# EAGLE design serialLogger (EAGLE 6.4)
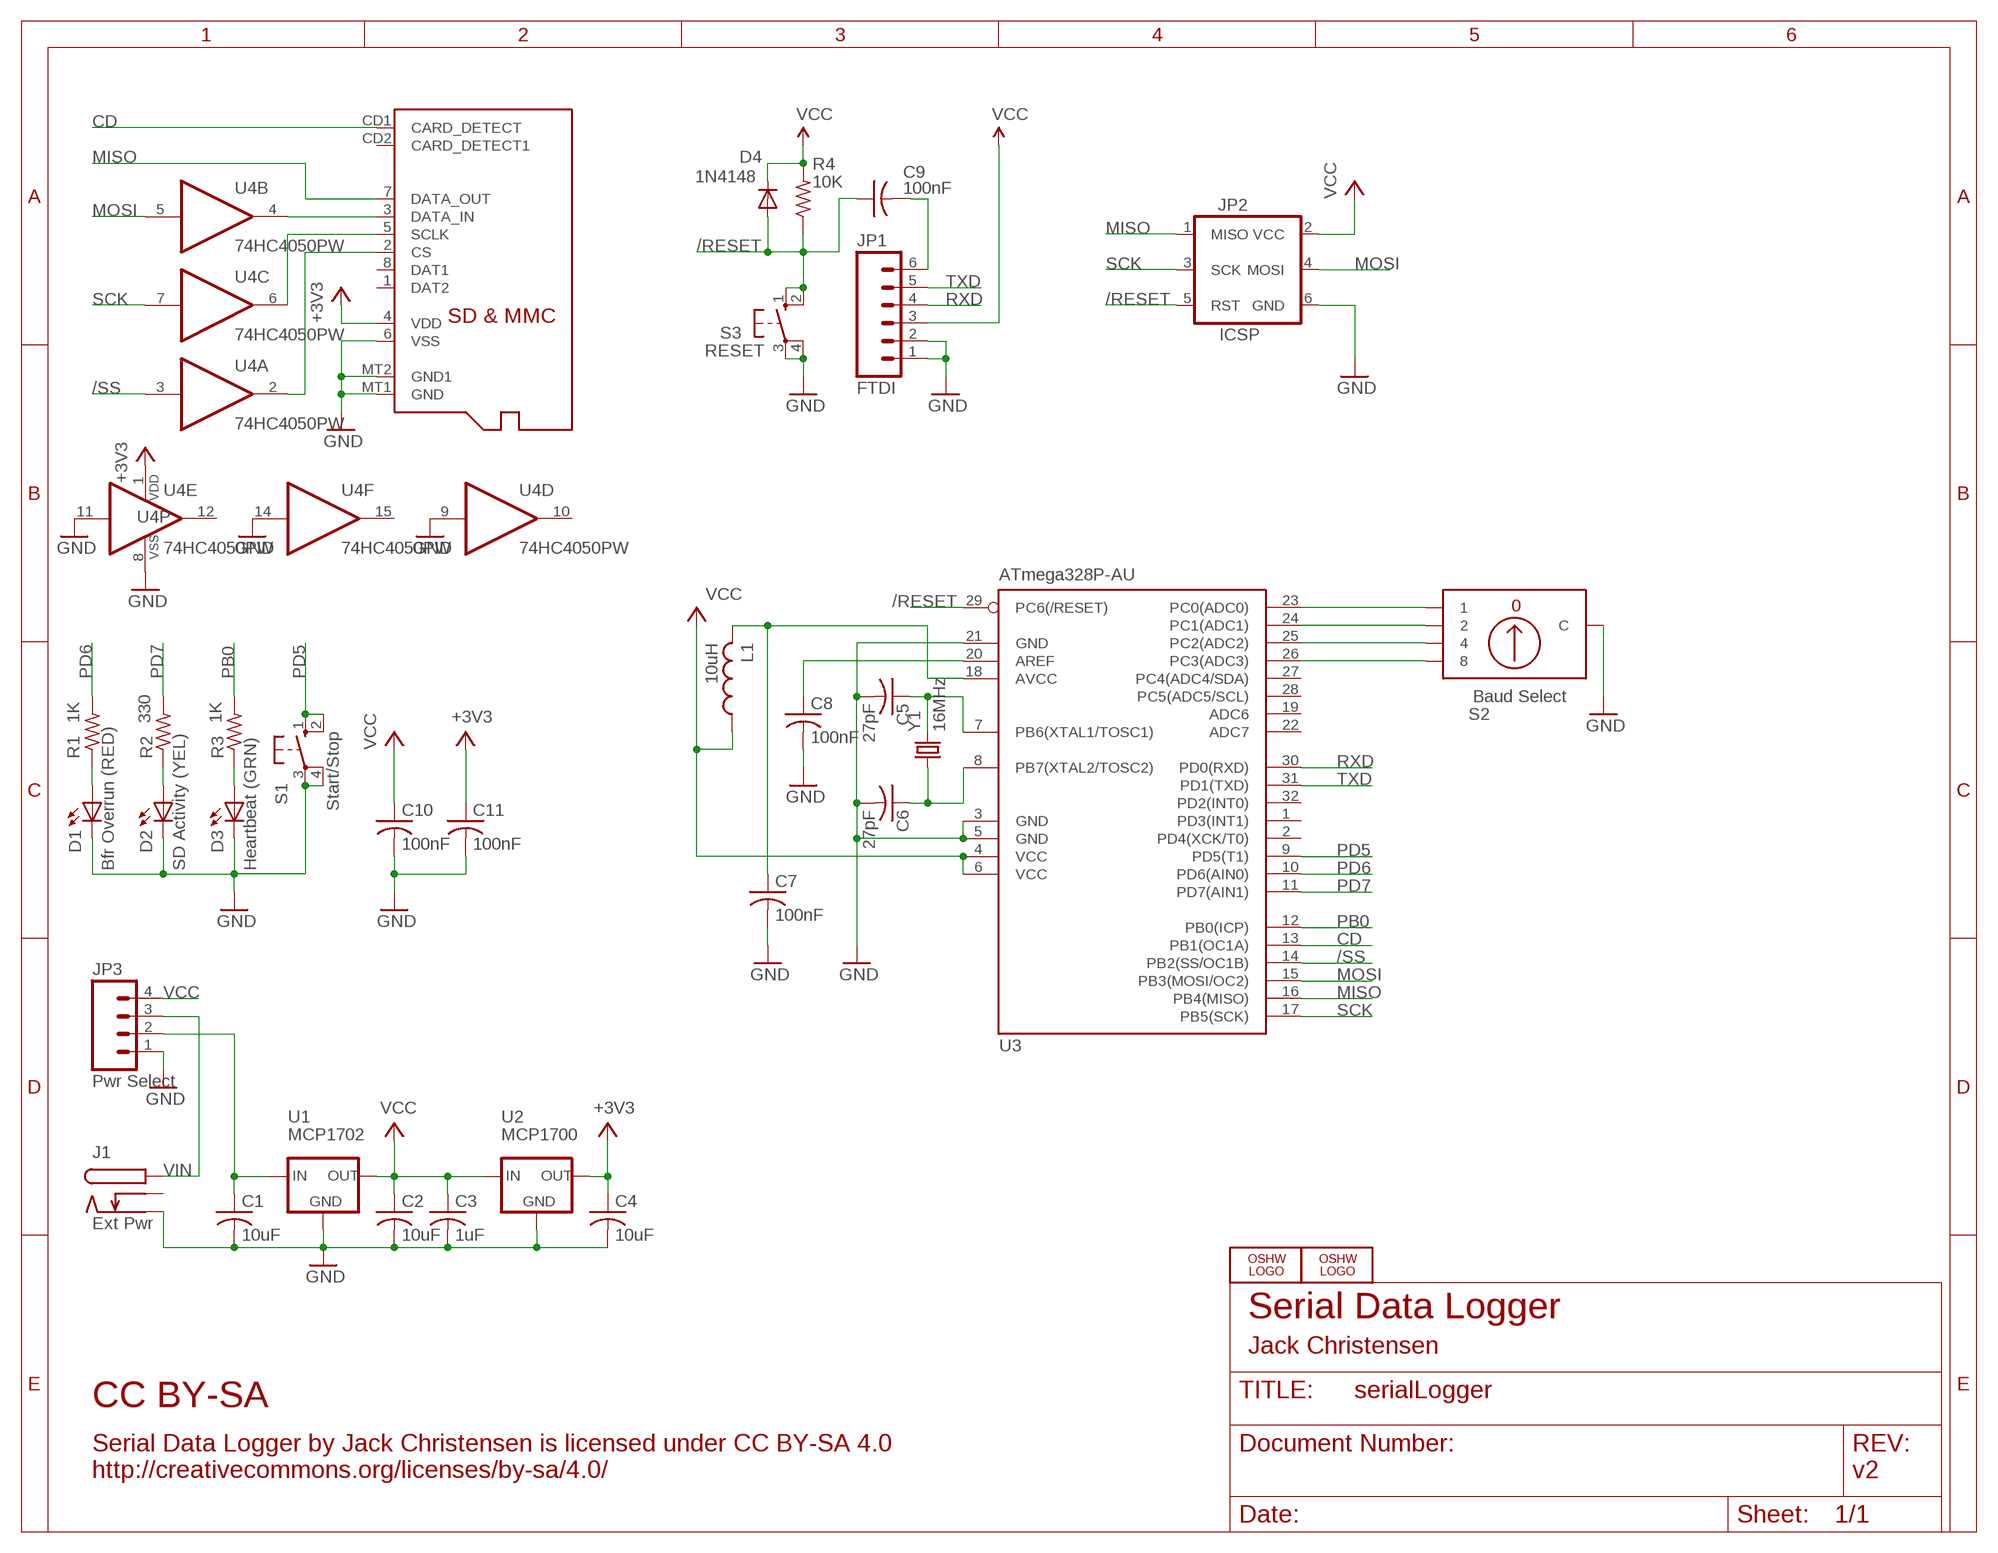
[diagram p0: schematic, sheet 1]

## Parts
C1  10uF  C-USM0805  [M0805]
C2  10uF  C-USM0805  [M0805]
C3  1uF  C-USM0805  [M0805]
C4  10uF  C-USM0805  [M0805]
C5  27pF  C-USM0805  [M0805]
C6  27pF  C-USM0805  [M0805]
C7  100nF  C-USM0805  [M0805]
C8  100nF  C-USM0805  [M0805]
C9  100nF  C-USM0805  [M0805]
C10  100nF  C-USM0805  [M0805]
C11  100nF  C-USM0805  [M0805]
D1  Bfr Overrun (RED)  LEDCHIPLED_1206  [CHIPLED_1206]
D2  SD Activity (YEL)  LEDCHIPLED_1206  [CHIPLED_1206]
D3  Heartbeat (GRN)  LEDCHIPLED_1206  [CHIPLED_1206]
D4  1N4148  DIODESOD-323F-A  [SOD-323F-A]
J1  Ext Pwr  POWER-JACK  [KLDX-0202]
JP1  FTDI  M06LOCK  [1X06_LOCK]
JP2  ICSP  AVR_SPI_PRG_62X3_LOCK  [2X3_LOCK]
JP3  Pwr Select  M04LOCK  [1X04_LOCK]
L1  10uH  INDUCTORM0805  [M0805]
LOGO1  OSHW_LOGO_10MILX0200-NT  [OSHW_10X200_NOTEXT]
LOGO2  OSHW_LOGO_10MILX0200-NT  [OSHW_10X200_NOTEXT]
R1  1K  R-US_M0805  [M0805]
R2  330  R-US_M0805  [M0805]
R3  1K  R-US_M0805  [M0805]
R4  10K  R-US_M0805  [M0805]
S1  Start/Stop  10-XXOCT  [B3F-10XXOCT]
S2  Baud Select  OMRON-A6RS-102  [OMRON-A6RS-102]
S3  RESET  10-XXOCT  [B3F-10XXOCT]
U1  MCP1702  MCP1700SOT89  [SOT89]
U2  MCP1700  MCP1700SOT23  [SOT23]
U3  ATmega328P-AU  MEGA8-AI  [TQFP32-08]
U4  74HC4050PW  4050PW  [TSSOP16]
X1  MICROSD  [MICROSD]
Y1  16MHz  CRYSTALABM2  [CRYSTAL-ABRACON-ABM2]

## Nets
+3V3: C4.1 C11.1 U2.2(OUT) U4.1(P:VDD) X1.4(VDD)
/RESET: C9.1 D4.A JP2.5(RST) R4.1 S3.1(S) S3.2(S1) U3.29(PC6(/RESET))
/SS: U3.14(PB2(SS/OC1B)) U4.3(A:I)
CD: U3.13(PB1(OC1A)) X1.CD1(CARD_DETECT)
GND: C1.2 C2.2 C3.2 C4.2 C5.2 C6.2 C7.2 C8.2 C10.2 C11.2 D1.C D2.C D3.C J1.P$2 JP1.1 JP1.2 JP2.6(GND) JP3.1 S1.3(P) S1.4(P1) S2.C.1(C) S2.C.2(C) S3.3(P) S3.4(P1) U1.1(GND) U2.1(GND) U3.3(GND) U3.5(GND) U3.21(GND) U4.8(P:VSS) U4.9(D:I) U4.11(E:I) U4.14(F:I) X1.6(VSS) X1.MT1(GND) X1.MT2(GND1)
MISO: JP2.1(MISO) U3.16(PB4(MISO)) X1.7(DATA_OUT)
MOSI: JP2.4(MOSI) U3.15(PB3(MOSI/OC2)) U4.5(B:I)
N$1: D3.A R3.1
N$2: D2.A R2.1
N$3: D1.A R1.1
N$4: C1.1 JP3.2 U1.2(IN) U1.2.1(IN)
N$5: S2.1 U3.23(PC0(ADC0))
N$6: S2.2 U3.24(PC1(ADC1))
N$7: S2.4 U3.25(PC2(ADC2))
N$8: S2.8 U3.26(PC3(ADC3))
N$10: U4.6(C:O) X1.5(SCLK)
N$15: U4.2(A:O) X1.2(CS)
N$17: U4.4(B:O) X1.3(DATA_IN)
N$18: C5.1 U3.7(PB6(XTAL1/TOSC1)) Y1.P$2
N$19: C6.1 U3.8(PB7(XTAL2/TOSC2)) Y1.P$1
N$20: C8.1 U3.20(AREF)
N$37: C7.1 L1.2 U3.18(AVCC)
PB0: R3.2 U3.12(PB0(ICP))
PD5: S1.1(S) S1.2(S1) U3.9(PD5(T1))
PD6: R1.2 U3.10(PD6(AIN0))
PD7: R2.2 U3.11(PD7(AIN1))
RST: C9.2 JP1.6
RXD: JP1.4 U3.30(PD0(RXD))
SCK: JP2.3(SCK) U3.17(PB5(SCK)) U4.7(C:I)
TXD: JP1.5 U3.31(PD1(TXD))
VCC: C2.1 C3.1 C10.1 D4.K JP1.3 JP2.2(VCC) JP3.4 L1.1 R4.2 U1.3(OUT) U2.3(IN) U3.4(VCC) U3.6(VCC)
VIN: J1.P$1 JP3.3
Unconnected: J1.P$3 U3.1(PD3(INT1)) U3.2(PD4(XCK/T0)) U3.19(ADC6) U3.22(ADC7) U3.27(PC4(ADC4/SDA)) U3.28(PC5(ADC5/SCL)) U3.32(PD2(INT0)) U4.10(D:O) U4.12(E:O) U4.15(F:O) X1.1(DAT2) X1.8(DAT1) X1.CD2(CARD_DETECT1)

## Notes on the sheet
- Serial Data Logger
- Jack Christensen
- CC BY-SA
- Serial Data Logger by Jack Christensen is licensed under CC BY-SA 4.0
  http://creativecommons.org/licenses/by-sa/4.0/
- v2

## Library data of the parts
C1-C11 = _jc:C-US: CAPACITOR, American symbol
D1-D3 = _jc:LED: LED OSRAM: - CHIPLED LG R971, LG N971, LY N971, LG Q971, LY Q971, LO R971, LY R971 LH N974, LH R974 LS Q976, LO Q976, LY Q976 LO Q996 - Hyper CHIPLED LW Q18S LB Q993, LB Q99A, LB R99A - SideLED LS A670, LO A670, LY A670, LG A670, LP A670 LB A673, LV A673, LT A673, LW A673 LH A674 LY A675 LS A676, LA A676, LO A676, LY A676, LW A676 LS A679, LY A679, LG A679 - Hyper Micro SIDELED® LS Y876, LA Y876, LO Y876, LY Y876 LT Y87S - SmartLED LW L88C, LW L88S LB L89C, LB L89S, LG L890 LS L89K, LO L89K, LY L89K LS L896, LA L896, LO L896, LY L896 - TOPLED LS T670, LO T670, LY T670, LG T670, LP T670 LSG T670, LSP T670, LSY T670, LOP T670, LYG T670 LG T671, LOG T671, LSG T671 LB T673, LV T673, LT T673, LW T673 LH T674 LS T676, LA T676, LO T676, LY T676, LB T676, LH T676, LSB T676, LW T676 LB T67C, LV T67C, LT T67C, LS T67K, LO T67K, LY T67K, LW E67C LS E67B, LA E67B, LO E67B, LY E67B, LB E67C, LV E67C, LT E67C LW T67C LS T679, LY T679, LG T679 LS T770, LO T770, LY T770, LG T770, LP T770 LB T773, LV T773, LT T773, LW T773 LH T774 LS E675, LA E675, LY E675, LS T675 LS T776, LA T776, LO T776, LY T776, LB T776 LHGB T686 LT T68C, LB T68C - Hyper Mini TOPLED® LB M676 - Mini TOPLED Santana® LG M470 LS M47K, LO M47K, LY M47K Source: http://www.osram.convergy.de/
D4 = _jc:DIODE
J1 = _jc:POWER-JACK
JP1 = SparkFun:M06: Header 6 Standard 6-pin 0.1" header. Use with straight break away headers (SKU : PRT-00116), right angle break away headers (PRT-00553), swiss pins (PRT-00743), machine pins (PRT-00117), and female headers (PRT-00115). Molex polarized connector foot print use with SKU : PRT-08094 with associated crimp pins and housings. NOTES ON THE VARIANTS LOCK and LOCK_LONGPADS... This footprint was designed to help hold the alignment of a through-hole component (i.e. 6-pin header) while soldering it into place. You may notice that each hole has been shifted either up or down by 0.005 of an inch from it's more standard position (which is a perfectly straight line). This slight alteration caused the pins (the squares in the middle) to touch the edges of the holes. Because they are alternating, it causes a "brace" to hold the component in place. 0.005 has proven to be the perfect amount of "off-center" position when using our standard breakaway headers. Although looks a little odd when you look at the bare footprint, once you have a header in there, the alteration is very hard to notice. Also, if you push a header all the way into place, it is covered up entirely on the bottom side. This idea of altering the position of holes to aid alignment will be further integrated into the Sparkfun Library for other footprints. It can help hold any component with 3 or more connection pins.
JP2 = _jc:AVR_SPI_PRG_6: AVR ISP 6 Pin This is the reduced ISP connector for AVR programming. Common on Arduino. This footprint will take up less PCB space and can be used with a 10-pin to 6-pin adapter such as SKU: BOB-08508
JP3 = SparkFun:M04: Header 4 Standard 4-pin 0.1" header. Use with straight break away headers (SKU : PRT-00116), right angle break away headers (PRT-00553), swiss pins (PRT-00743), machine pins (PRT-00117), and female headers (PRT-00115). Molex polarized connector foot print use with SKU : PRT-08231 with associated crimp pins and housings.
L1 = _jc:INDUCTOR: Murata #11R472C
LOGO1 LOGO2 = ohw-logo:OSHW_LOGO_10MIL
R1-R4 = _jc:R-US_: RESISTOR, American symbol
S1 S3 = _jc:10-XX: OMRON SWITCH
S2 = _jc:OMRON-A6RS-102
U1 U2 = _jc:MCP1700: VOLTAGE REGULATOR
U3 = atmel:MEGA8: MICROCONTROLLER 8 Kbytes FLASH, 1 kbytes SRAM, 512 bytes EEPROM, USART, 6-channel 10 bit ADC, 2-channel 8 bit ADC Pin compatible with Atmega48, ATMega88, ATMega168 Source: avr.lbr; MPN: ATMEGA8-16AU; OC_FARNELL: 9171371; OC_NEWARK: 73M8863
U4 = 40xx:4050: Hex non-inverting BUFFER
X1 = adafruit:MICROSD: Micro-SD / Transflash card holder with SPI pinout For the 3M # 2908-05WB-MG and/or 4UCON #19656 push-push type
Y1 = _jc:CRYSTAL

## Board
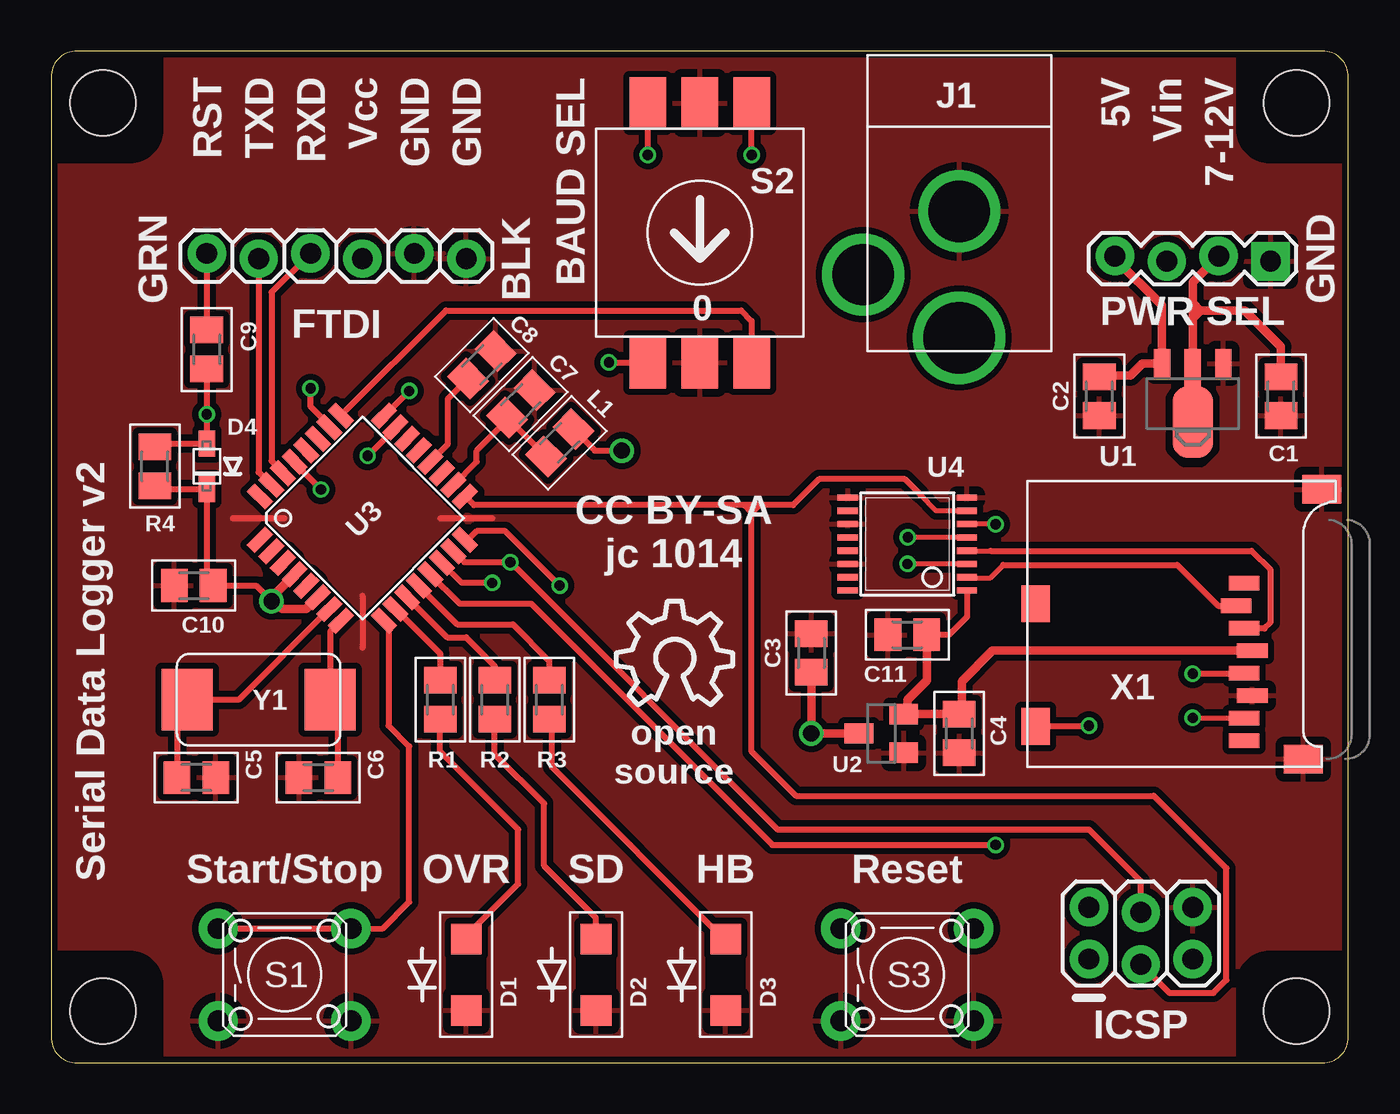
[diagram p1: board, top side]
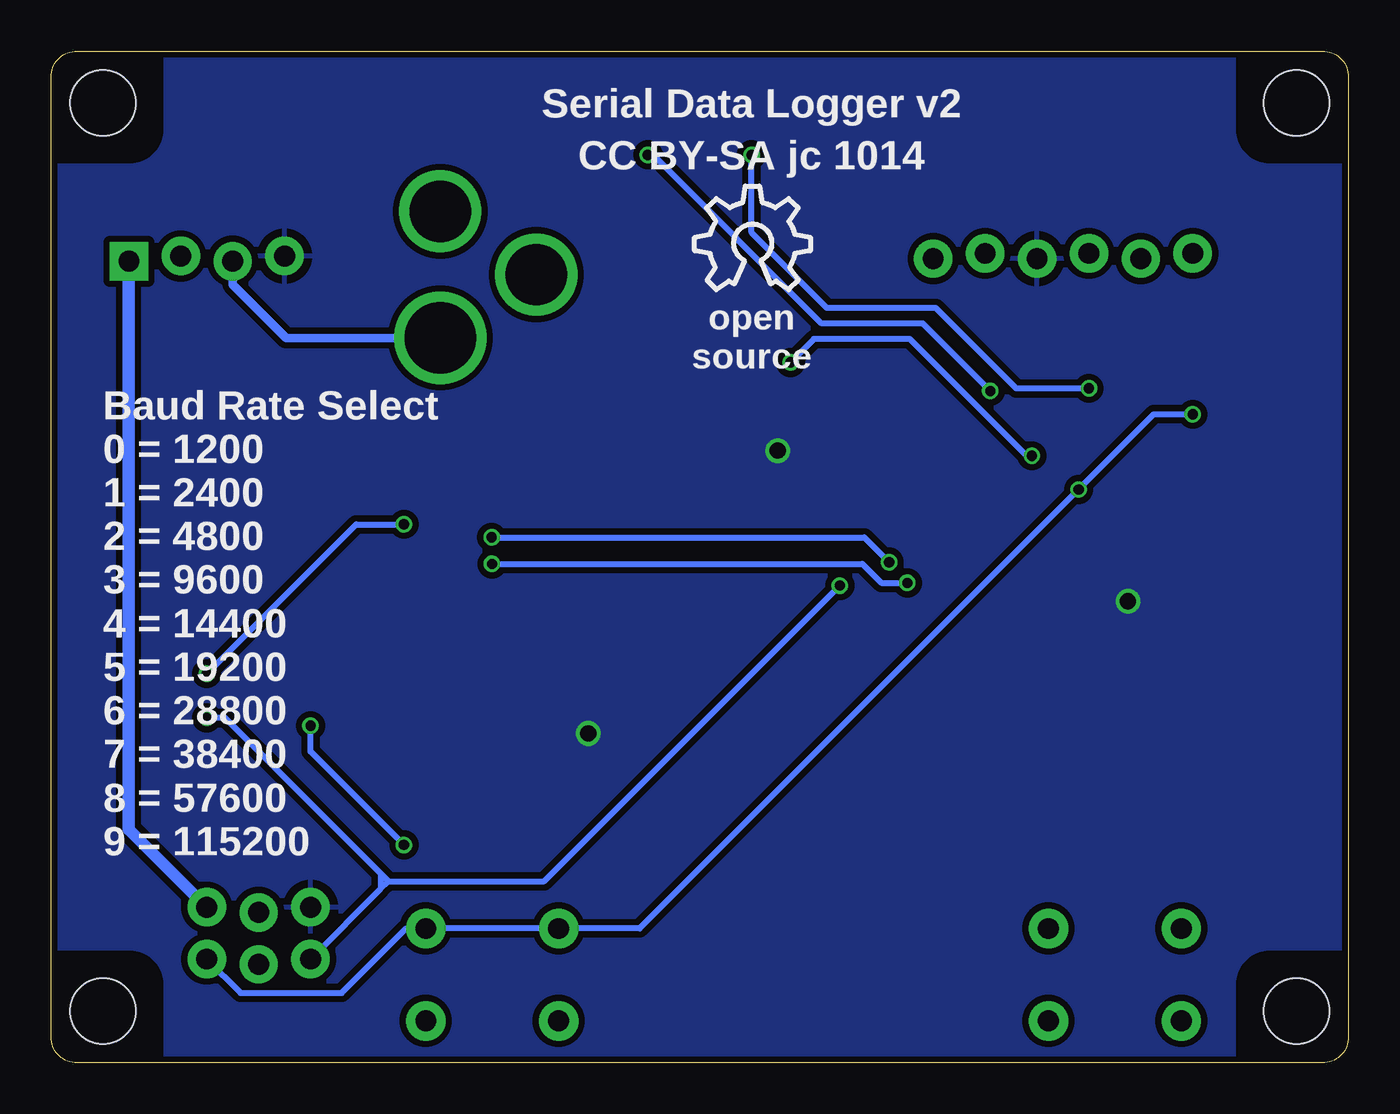
[diagram p2: board, bottom side, seen from below]

Size 63.5 x 49.53 mm. Coordinates in mm from the lower left corner, seen from the top.
Outline: 63.5,1.27 63.5,48.26 arc90 62.23,49.53 1.27,49.53 arc90 0,48.26 0,1.27 arc90 1.27,0 62.23,0 arc90 63.5,1.27
Copper layers (1*16): Top 0.035mm / dielectric 1.5mm / Bottom 0.035mm
Design rules "SeeedStudio_DRU_jc_20140311 *": minimum track width 8mil, minimum drill 12mil, track to track 8mil, track to pad 8mil, pad to pad 8mil, via to via 8mil, smd to smd 0mil, copper to edge 10mil, drill to drill 10mil, minimum pad ring 6mil, minimum via ring 6mil, stop-mask expansion 2mil, vias tented up to drill 25mil, thermal gap 16mil
Holes 3.2 mm at 2.54,2.54 60.96,2.54 2.54,46.99 60.96,46.99
tRestrict: area 0,44.5 to 5.1,49.5; area 58.4,44.5 to 63.5,49.5; area 58.4,0 to 63.5,5.1; area 0,0 to 5.1,5.1
bRestrict: area 58.4,44.5 to 63.5,49.5; area 0,44.5 to 5.1,49.5; area 0,0 to 5.1,5.1; area 58.4,0 to 63.5,5.1

### Footprints (pad centres in the part's own frame; a part is rotated, then mirrored left to right if it is on the bottom)
M0805 = smd 1.3 x 1.6: 1 -0.95,0; 2 0.95,0
CHIPLED_1206 = smd 1.5 x 1.5: A 0,-1.75; C 0,1.75
SOD-323F-A = smd 1.27 x 0.813: A -1.118,0; K 1.118,0
KLDX-0202 = drill 3.5: P$1 6.55,0 | drill 3: P$2 0.35,0; P$3 3.45,-4.7
1X06_LOCK = drill 1.016 pad 1.88: 1 0,0; 2 2.54,-0.254; 3 5.08,0; 4 7.62,-0.254; 5 10.16,0; 6 12.7,-0.254
2X3_LOCK = drill 1.016 pad 1.88: 1 0,0; 2 0,2.54; 3 2.54,-0.254; 4 2.54,2.286; 5 5.08,0; 6 5.08,2.54
1X04_LOCK = drill 1.016 pad 1.88 square: 1 0,0.127 | drill 1.016 pad 1.88: 2 2.54,-0.127; 3 5.08,0.127; 4 7.62,-0.127
B3F-10XXOCT = drill 1.016 pad 1.93: 1 -3.251,2.261; 2 3.251,2.261; 3 -3.251,-2.261; 4 3.251,-2.261
OMRON-A6RS-102 = smd 1.778 x 2.54: 1 -2.54,-6.35; 2 2.54,6.35; 4 2.54,-6.35; 8 -2.54,6.35; C.1 0,-6.35; C.2 0,6.35
SOT89 = smd 0.8 x 1.4: 1 -1.499,-1.981; 3 1.499,-1.981 | smd 0.8 x 1.9: 2 0,-1.727 | smd 2 x 3.5: 2.1 0,0.889
SOT23 = smd 1 x 1.4: 1 -0.95,-1.1; 2 0.95,-1.1; 3 0,1.1
TQFP32-08 = smd 1.27 x 0.559: 1 -4.293,2.8; 2 -4.293,2; 3 -4.293,1.2; 4 -4.293,0.4; 5 -4.293,-0.4; 6 -4.293,-1.2; 7 -4.293,-2; 8 -4.293,-2.8; 17 4.293,-2.8; 18 4.293,-2; 19 4.293,-1.2; 20 4.293,-0.4; 21 4.293,0.4; 22 4.293,1.2; 23 4.293,2; 24 4.293,2.8 | smd 0.559 x 1.27: 9 -2.8,-4.293; 10 -2,-4.293; 11 -1.2,-4.293; 12 -0.4,-4.293; 13 0.4,-4.293; 14 1.2,-4.293; 15 2,-4.293; 16 2.8,-4.293; 25 2.8,4.293; 26 2,4.293; 27 1.2,4.293; 28 0.4,4.293; 29 -0.4,4.293; 30 -1.2,4.293; 31 -2,4.293; 32 -2.8,4.293
TSSOP16 = smd 0.305 x 0.991: 1 -2.275,-2.918; 2 -1.625,-2.918; 3 -0.975,-2.918; 4 -0.325,-2.918; 5 0.325,-2.918; 6 0.975,-2.918; 7 1.625,-2.918; 8 2.275,-2.918; 9 2.275,2.918; 10 1.625,2.918; 11 0.975,2.918; 12 0.325,2.918; 13 -0.325,2.918; 14 -0.975,2.918; 15 -1.625,2.918; 16 -2.275,2.918
MICROSD = smd 0.7 x 1.5: 1 9,-10.64; 2 7.9,-10.24; 3 6.8,-10.64; 4 5.7,-11.04; 5 4.6,-10.64; 6 3.5,-11.04; 7 2.4,-10.64; 8 1.3,-10.64 | smd 1.8 x 1.4: CD1 2,-0.44; CD2 8,-0.44 | smd 1.4 x 1.9: MT1 0.4,-13.54; MT2 13.6,-14.44
CRYSTAL-ABRACON-ABM2 = smd 2.5 x 3: P$1 -3.5,0; P$2 3.5,0

### Placement (x,y rotation side)
C1  60.2,32.64 270 top
C2  51.31,32.64 270 top
C3  37.21,20.07 90 top
C4  44.45,16.13 270 top
C5  7.11,13.97 0 top
C6  13.08,13.97 180 top
C7  22.99,32.26 45 top
C8  21.08,34.16 45 top
C9  7.62,34.92 90 top
C10  6.99,23.37 180 top
C11  41.91,20.95 180 top
D1  20.32,4.32 180 top
D2  26.67,4.32 180 top
D3  33.02,4.32 180 top
D4  7.62,29.21 270 top
J1  44.45,42.04 270 top
JP1  20.32,39.37 180 top
JP2  50.8,5.08 0 top
JP3  59.69,39.37 180 top
L1  24.89,30.35 225 top
LOGO1  27.69,17.53 0 top
LOGO2  32,37.85 0 bottom
R1  19.05,17.78 90 top
R2  21.72,17.78 90 top
R3  24.38,17.78 90 top
R4  5.08,29.21 270 top
S1  11.43,4.32 0 top
S2  31.75,40.64 0 top
S3  41.91,4.32 0 top
U1  55.88,32.26 180 top
U2  40.64,16.13 90 top
U3  15.24,26.67 45 top
U4  41.91,25.4 90 top
X1  47.75,14.48 90 top
Y1  10.16,17.78 180 top

### Tracks (layer width: path | path; a pad name or v marks a point on that pad's centre or on a via)
+3V3
  Top 0.305: U4.1 44.83,21.84 43.94,20.95 C11.1
  Top 0.406: X1.4 46.09,20.18 44.58,18.67 44.58,17.21 C4.1 U2.2 41.91,17.25 41.91,17.78 42.86,18.73 C11.1
/RESET  (via drill 0.5)
  Top 0.305: U3.29 11.92,29.35 v13.21,28.07 | C9.1 v7.62,31.75 D4.A 5.25,30.33 R4.1
  Bottom 0.305: JP2.5 54.23,3.43 49.28,3.43 46.13,6.58 S3.2 S3.1 34.7,6.58 v13.21,28.07 9.53,31.75 v7.62,31.75
/SS  (via drill 0.5)
  Top 0.254: U4.3 v41.92,24.43
  Top 0.305: v21.59,23.5 20.11,23.5 U3.14
  Bottom 0.305: v21.59,23.5 22.86,23.5 23.79,24.43 v41.92,24.43
CD  (via drill 0.5)
  Top 0.305: U3.13 20,22.48 23.5,22.48 35.31,10.67 v46.23,10.67 | v50.8,16.51 50.77,16.48 X1.CD1
  Bottom 0.305: v46.23,10.67 50.8,15.24 v50.8,16.51
GND
  Top 0.305: 15.24,22.86 15.24,20.32 | 19.05,26.67 21.59,26.67 | 8.89,26.67 11.43,26.67
  Bottom 0.61: JP2.6 59.69,11.43 JP3.1
  pour Top (isolate 0.305): 64.77,-1.27 -1.27,-1.27 -1.27,50.8 64.77,50.8
MISO  (via drill 0.5)
  Top 0.254: v55.88,16.89 58.38,16.89 X1.7
  Top 0.305: v24.89,23.37 22.23,26.04 20.83,26.04 20.41,25.61 U3.16
  Bottom 0.305: v24.89,23.37 39.37,8.89 46.99,8.89 | JP2.1 47.37,8.51 | 47.37,8.51 46.99,8.89 | 46.99,8.89 47.37,9.27 | 47.37,9.27 54.99,16.89 v55.88,16.89 | 47.37,9.27 47.37,8.51
MOSI  (via drill 0.5)
  Top 0.254: U4.5 v41.94,25.73
  Top 0.305: U3.15 20.23,24.51 v22.48,24.51 35.56,11.43 50.8,11.43 53.34,8.89 JP2.4
  Bottom 0.305: v41.94,25.73 23.7,25.73 v22.48,24.51
N$1
  Top 0.305: D3.A 32.92,6.07 24.51,14.48 24.51,16.7 R3.1
N$2
  Top 0.305: D2.A 26.67,7.11 24.13,9.65 24.13,12.7 21.72,15.11 R2.1
N$3
  Top 0.305: D1.A 20.32,6.22 22.86,8.76 22.86,11.43 19.05,15.24 R1.1
N$4
  Top 0.406: JP3.2 55.88,38.23 55.88,37.21 | 55.88,37.21 55.88,36.83 | 55.88,36.45 U1.2 U1.2.1 | C1.1 60.2,35.05 58.42,36.83 56.26,36.83 | 56.26,36.83 55.88,36.83 | 56.26,36.83 55.88,36.45 | 55.88,36.45 55.88,36.83 | 55.88,37.21 56.26,36.83
N$5  (via drill 0.5)
  Top 0.305: U3.23 16.86,31.09 v15.49,29.72 | v27.3,34.29 S2.1
  Bottom 0.305: v15.49,29.72 15.75,29.72 21.46,35.43 26.16,35.43 v27.3,34.29
N$6  (via drill 0.5)
  Top 0.305: U3.24 16.32,31.68 v17.53,32.89 | v34.29,44.45 S2.2
  Bottom 0.305: v17.53,32.89 20.83,36.2 25.78,36.2 34.04,44.45 v34.29,44.45
N$7
  Top 0.305: U3.25 19.33,36.83 33.78,36.83 34.29,36.32 S2.4
N$8  (via drill 0.5)
  Top 0.305: U3.26 13.62,31.21 12.7,32.13 v12.7,33.02 | v29.21,44.45 S2.8
  Bottom 0.305: v29.21,44.45 29.21,40.64 25.53,36.96 20.19,36.96 16.26,33.02 v12.7,33.02
N$10  (via drill 0.5)
  Top 0.254: v46.23,26.36 46.22,26.38 U4.6
  Top 0.305: X1.5 58.36,19.05 v55.88,19.05
  Bottom 0.305: v55.88,19.05 48.56,26.36 v46.23,26.36
N$15
  Top 0.254: U4.2 44.85,23.75 45.97,23.75 46.61,24.38
  Top 0.305: 57.97,22.35 X1.2 57.12,22.38 55.12,24.38 46.61,24.38
N$17
  Top 0.254: U4.4 46,25.07
  Top 0.305: X1.3 58.41,21.26 59.38,21.26 59.69,21.57 59.69,24.13 58.75,25.07 46,25.07
N$18
  Top 0.305: U3.7 9.18,17.78 Y1.P$2 6.16,17.28 C5.1
N$19
  Top 0.305: U3.8 13.66,21.13 Y1.P$1 14.03,17.41 C6.1
N$20
  Top 0.305: U3.20 19.43,30.3 19.43,32.51 C8.1
N$37
  Top 0.305: U3.18 20.83,29.43 20.83,29.97 22.32,31.46 C7.1 L1.2
PB0
  Top 0.305: U3.12 19.88,21.46 22.61,21.46 24.38,19.68 R3.2
PD5
  Top 0.305: S1.1 S1.2 16.22,6.57 17.53,7.87 17.53,15.49 16.51,16.51 16.51,21.44 U3.9
PD6
  Top 0.305: U3.10 19.05,20.03 R1.2
PD7
  Top 0.305: U3.11 19.39,20.83 20.32,20.83 21.72,19.43 R2.2
RST
  Top 0.305: JP1.6 C9.2
RXD
  Top 0.305: JP1.4 10.79,37.72 10.79,29.46 11.36,28.9 U3.30
SCK
  Top 0.254: U4.7 43.33,27.02 42.55,27.81
  Top 0.305: 42.55,27.81 41.78,28.57 37.59,28.57 36.32,27.3 34.67,27.3 | 34.67,27.3 34.29,27.3 | 34.29,27.3 33.91,27.3 | 33.91,27.3 20.7,27.3 20.28,27.73 U3.17 | 34.29,26.92 34.29,15.24 36.45,13.08 53.98,13.08 57.53,9.53 57.53,4.06 56.9,3.43 54.74,3.43 JP2.3 | 34.29,26.92 34.29,27.3 | 34.67,27.3 34.29,26.92 | 34.29,26.92 33.91,27.3
TXD
  Top 0.305: JP1.5 10.16,28.92 U3.31
VCC  (via drill 0.8)
  Top 0.305: L1.1 26.62,29.97 v27.94,29.97 | v10.79,22.61 10.03,23.37 C10.1 7.93,23.82 7.62,24.13 D4.K 5.25,28.09 R4.2
  Top 0.406: C3.1 v37.21,16.13 U2.3 | U3.4 10.79,22.79 v10.79,22.61 10.92,22.61 11.3,22.23 12.49,22.23 U3.6 | JP3.4 52.07,39.37 54.36,37.08 54.36,34.26 U1.3 53.42,34.24 52.83,33.66 51.37,33.66 C2.1
  pour Bottom (isolate 0.305): -2.54,-2.54 -2.54,52.07 66.04,52.07 66.04,-2.54
VIN
  Bottom 0.406: J1.P$1 52,35.49 54.61,38.1 JP3.3

### Text on the board
tPlace: RST | TXD | RXD | Vcc | GND | GND | BAUD SEL | 5V | Vin | 7-12V | GRN | BLK | GND | PWR SEL | FTDI | CC BY-SA / jc 1014 | open / source | Start/Stop | OVR | SD | HB | Reset | Serial Data Logger v2 | ICSP
bPlace: Serial Data Logger v2 | CC BY-SA jc 1014 | open / source | Baud Rate Select / 0 = 1200 / 1 = 2400 / 2 = 4800 / 3 = 9600 / 4 = 14400 / 5 = 19200 / 6 = 28800 / 7 = 38400 / 8 = 57600 / 9 = 115200